# EAGLE design ts (EAGLE 7.6.0)
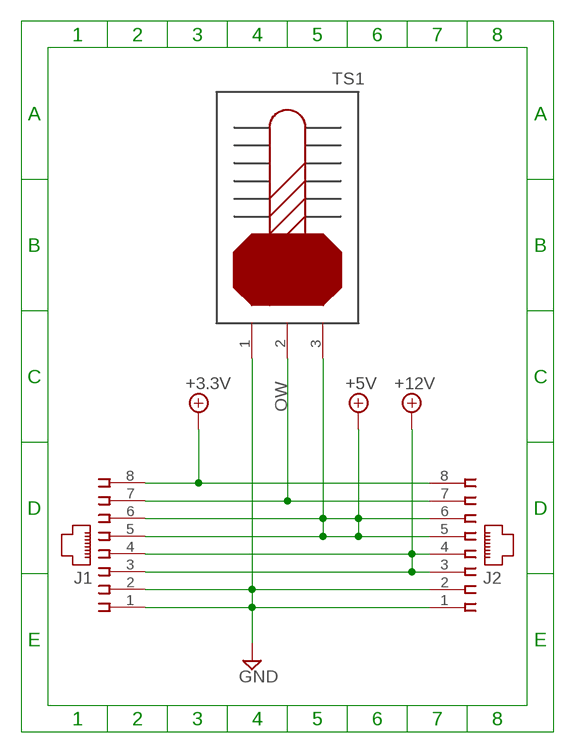
[diagram p0: schematic, sheet 1]

## Parts
J1  215877-4  [215877-4]
J2  215877-4  [215877-4]
TS1  DS18B20  [KK-156-3]

## Nets
+3P3V: J1.8 J2.8 ; supply symbol labelled +3.3V
+5V: J1.5 J1.6 J2.5 J2.6 TS1.3
+12V: J1.3 J1.4 J2.3 J2.4
GND: J1.1 J1.2 J2.1 J2.2 TS1.1
OW: J1.7 J2.7 TS1.2

## Library data of the parts
J1 J2 = Custom:215877-4: AMP connector
TS1 = Custom:DS18B20: DS18B20 One wire temperature sensor.

## Board
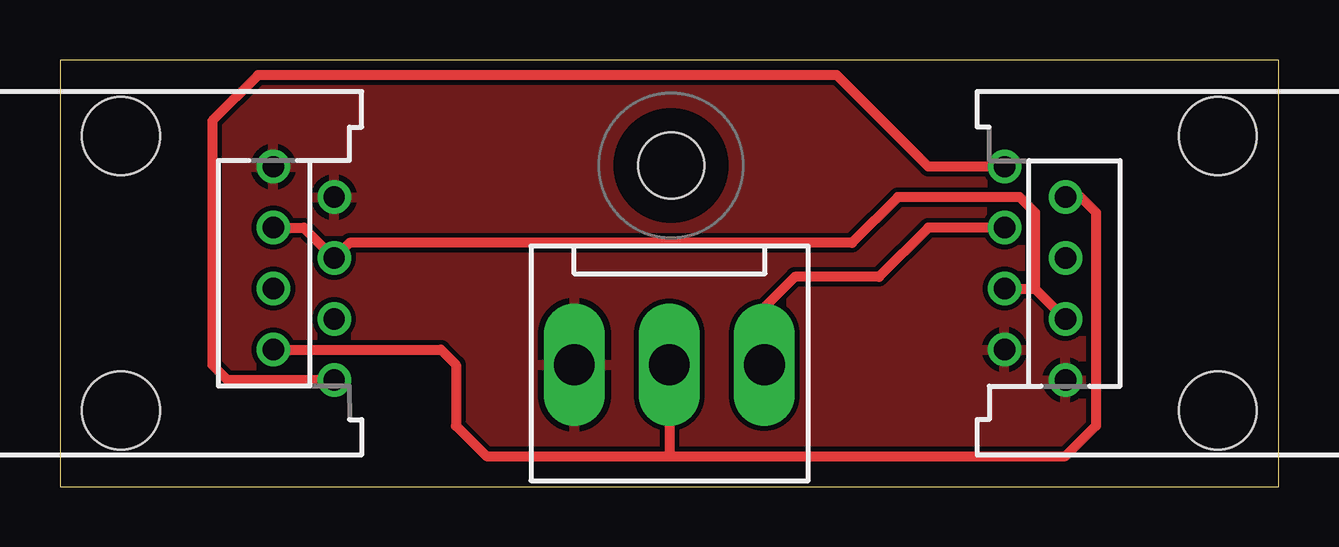
[diagram p1: board, top side]
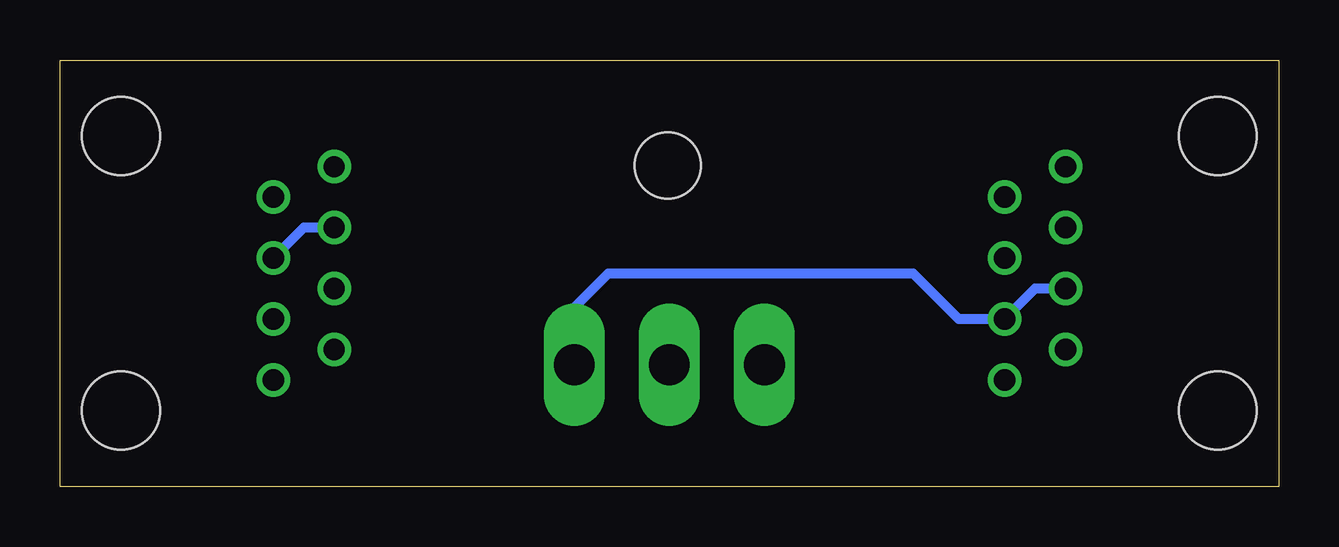
[diagram p2: board, bottom side, seen from below]

Size 50.8 x 17.78 mm. Coordinates in mm from the lower left corner, seen from the top.
Outline: 0,0 50.8,0 50.8,17.78 0,17.78 0,0
Copper layers (1*16): Top 0.035mm / dielectric 1.5mm / Bottom 0.035mm
Design rules "default": minimum track width 10mil, minimum drill 24mil, track to track 8mil, track to pad 8mil, pad to pad 8mil, via to via 8mil, smd to smd 8mil, copper to edge 40mil, drill to drill 8mil, minimum pad ring 10mil, minimum via ring 8mil, stop-mask expansion 4mil, vias tented up to drill 0mil, thermal gap 10mil
Holes 2.75 mm at 25.47,13.38

### Footprints (pad centres in the part's own frame; a part is rotated, then mirrored left to right if it is on the bottom)
215877-4 = drill 0.889: 1 -4.445,6.35; 2 -3.175,8.89; 3 -1.905,6.35; 4 -0.635,8.89; 5 0.635,6.35; 6 1.905,8.89; 7 3.175,6.35; 8 4.445,8.89 | hole 3.251: -5.715,0; 5.715,0
KK-156-3 = drill 1.7 pad 2.184 long: 1 -3.96,0; 2 0,0; 3 3.96,0

### Placement (x,y rotation side)
J1  2.54,8.89 270 top
J2  48.26,8.89 90 top
TS1  25.4,5.08 0 top

### Tracks (layer width: path | path; a pad name or v marks a point on that pad's centre or on a via)
+3P3V
  Top 0.406: J2.8 36.2,13.34 32.38,17.14 8.26,17.14 6.35,15.24 6.35,5.08 6.99,4.45 J1.8
+5V
  Top 0.406: J2.6 36.2,10.79 34.14,8.74 30.63,8.74 29.36,7.47 TS1.3
  Bottom 0.406: TS1.3 29.36,7.47 27.94,8.89 15.24,8.89 13.34,6.99 J1.6 10.16,8.26 J1.5 | J2.6 40.64,10.79 J2.5
+12V
  Top 0.406: J1.3 10.16,10.79 J1.4 12.06,10.16 33.02,10.16 34.92,12.06 40.01,12.06 40.64,11.43 40.64,8.26 | J2.4 40.64,8.26 | 40.64,8.26 J2.3
GND
  pour Top: -1.27,19.05 -1.27,-1.27 52.07,-1.27 52.07,19.05
OW
  Top 0.406: J1.7 15.88,5.71 16.51,5.08 16.51,2.54 17.78,1.27 25.4,1.27 | 25.4,1.27 41.91,1.27 43.18,2.54 43.18,11.43 42.55,12.06 J2.7 | TS1.2 25.4,1.27